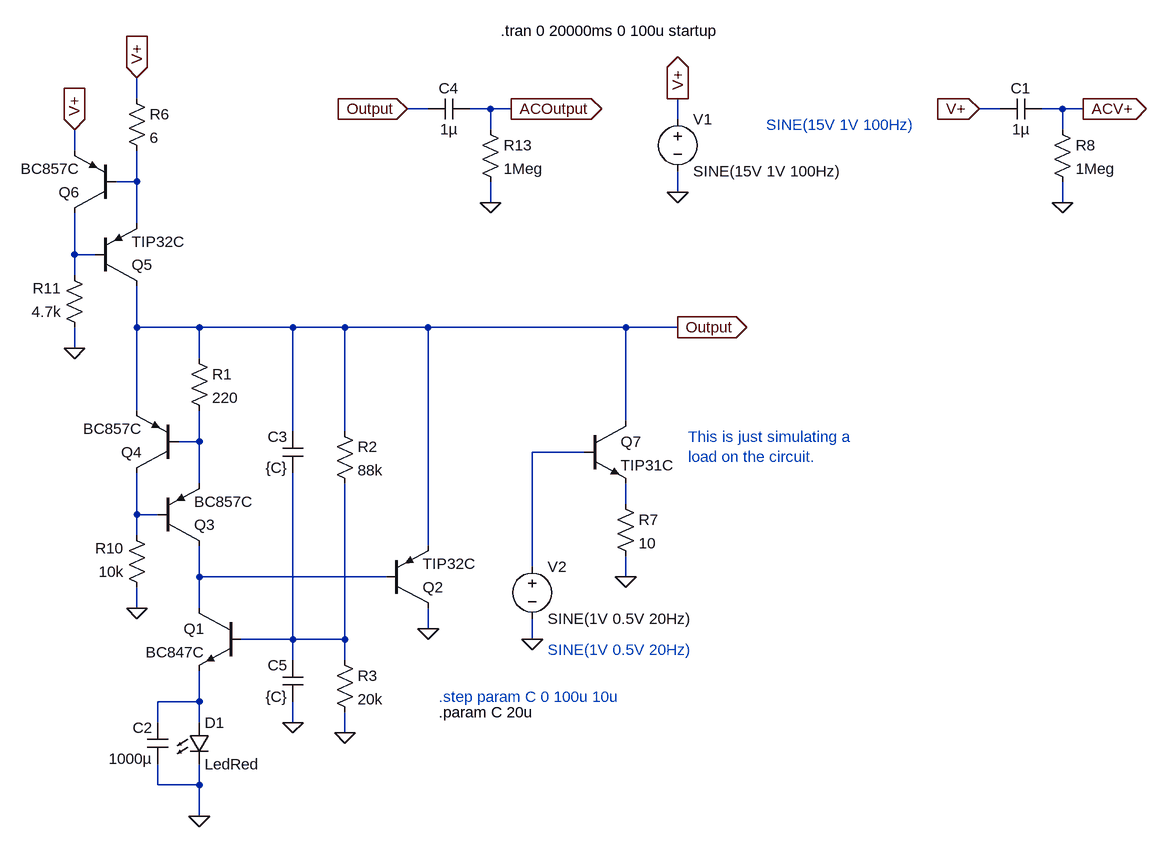
[diagram p0: schematic Shunt Regulator.asc]
Shunt Regulator.asc, the LTspice schematic file:
Version 4
SHEET 1 4220 820
WIRE 896 -304 896 -336
WIRE 1344 -288 1312 -288
WIRE 1440 -288 1408 -288
WIRE 1472 -288 1440 -288
WIRE 2224 -288 2192 -288
WIRE 2320 -288 2288 -288
WIRE 2352 -288 2320 -288
WIRE 1728 -272 1728 -304
WIRE 1440 -256 1440 -288
WIRE 2320 -256 2320 -288
WIRE 800 -224 800 -256
WIRE 896 -176 896 -224
WIRE 896 -176 864 -176
WIRE 1728 -160 1728 -192
WIRE 1440 -144 1440 -176
WIRE 2320 -144 2320 -176
WIRE 896 -112 896 -176
WIRE 800 -64 800 -128
WIRE 832 -64 800 -64
WIRE 800 -32 800 -64
WIRE 896 48 896 -16
WIRE 992 48 896 48
WIRE 1136 48 992 48
WIRE 1216 48 1136 48
WIRE 1344 48 1216 48
WIRE 1648 48 1344 48
WIRE 1728 48 1648 48
WIRE 800 80 800 48
WIRE 992 96 992 48
WIRE 896 176 896 48
WIRE 1648 192 1648 48
WIRE 1136 208 1136 48
WIRE 1216 208 1216 48
WIRE 992 224 992 176
WIRE 992 224 960 224
WIRE 1584 240 1504 240
WIRE 992 288 992 224
WIRE 1648 320 1648 288
WIRE 896 336 896 272
WIRE 928 336 896 336
WIRE 896 368 896 336
WIRE 1344 384 1344 48
WIRE 1504 416 1504 240
WIRE 992 432 992 384
WIRE 1280 432 992 432
WIRE 1648 432 1648 400
WIRE 896 480 896 448
WIRE 992 480 992 432
WIRE 1344 512 1344 480
WIRE 1136 528 1136 272
WIRE 1136 528 1056 528
WIRE 1216 528 1216 288
WIRE 1216 528 1136 528
WIRE 1504 528 1504 496
WIRE 1136 560 1136 528
WIRE 1216 560 1216 528
WIRE 992 624 992 576
WIRE 992 624 928 624
WIRE 928 656 928 624
WIRE 992 656 992 624
WIRE 1136 656 1136 624
WIRE 1216 672 1216 640
WIRE 928 752 928 720
WIRE 992 752 992 720
WIRE 992 752 928 752
WIRE 992 800 992 752
FLAG 1728 -160 0
FLAG 1728 -304 V+
IOPIN 1728 -304 Out
FLAG 1344 512 0
FLAG 896 480 0
FLAG 896 -336 V+
IOPIN 896 -336 In
FLAG 800 80 0
FLAG 800 -256 V+
IOPIN 800 -256 In
FLAG 1312 -288 Output
IOPIN 1312 -288 In
FLAG 1440 -144 0
FLAG 1472 -288 ACOutput
IOPIN 1472 -288 Out
FLAG 992 800 0
FLAG 1216 672 0
FLAG 1728 48 Output
IOPIN 1728 48 Out
FLAG 1504 528 0
FLAG 1648 432 0
FLAG 2192 -288 V+
IOPIN 2192 -288 In
FLAG 2320 -144 0
FLAG 2352 -288 ACV+
IOPIN 2352 -288 Out
FLAG 1136 656 0
SYMBOL voltage 1728 -288 R0
WINDOW 123 0 0 Left 0
WINDOW 39 0 0 Left 0
SYMATTR InstName V1
SYMATTR Value SINE(15V 1V 100Hz)
SYMBOL pnp 928 384 M180
SYMATTR InstName Q3
SYMATTR Value BC857C
SYMBOL res 912 464 R180
WINDOW 0 36 76 Left 2
WINDOW 3 36 40 Left 2
SYMATTR InstName R10
SYMATTR Value 10k
SYMBOL pnp 960 272 R180
SYMATTR InstName Q4
SYMATTR Value BC857C
SYMBOL res 880 -320 R0
SYMATTR InstName R6
SYMATTR Value 6
SYMBOL pnp 832 -16 M180
SYMATTR InstName Q5
SYMATTR Value TIP32C
SYMBOL res 816 64 R180
WINDOW 0 36 76 Left 2
WINDOW 3 36 40 Left 2
SYMATTR InstName R11
SYMATTR Value 4.7k
SYMBOL pnp 864 -128 R180
SYMATTR InstName Q6
SYMATTR Value BC857C
SYMBOL cap 1408 -304 R90
WINDOW 0 0 32 VBottom 2
WINDOW 3 32 32 VTop 2
SYMATTR InstName C4
SYMATTR Value 1µ
SYMBOL res 1424 -272 R0
SYMATTR InstName R13
SYMATTR Value 1Meg
SYMBOL npn 1056 480 M0
SYMATTR InstName Q1
SYMATTR Value BC847C
SYMBOL LED 976 656 R0
SYMATTR InstName D1
SYMATTR Value LedRed
SYMBOL res 976 80 R0
SYMATTR InstName R1
SYMATTR Value 220
SYMBOL res 1200 192 R0
SYMATTR InstName R2
SYMATTR Value 88k
SYMBOL res 1200 544 R0
SYMATTR InstName R3
SYMATTR Value 20k
SYMBOL pnp 1280 480 M180
SYMATTR InstName Q2
SYMATTR Value TIP32C
SYMBOL npn 1584 192 R0
SYMATTR InstName Q7
SYMATTR Value TIP31C
SYMBOL voltage 1504 400 R0
WINDOW 123 0 0 Left 0
WINDOW 39 0 0 Left 0
SYMATTR InstName V2
SYMATTR Value SINE(1V 0.5V 20Hz)
SYMBOL res 1632 304 R0
SYMATTR InstName R7
SYMATTR Value 10
SYMBOL cap 2288 -304 R90
WINDOW 0 0 32 VBottom 2
WINDOW 3 32 32 VTop 2
SYMATTR InstName C1
SYMATTR Value 1µ
SYMBOL res 2304 -272 R0
SYMATTR InstName R8
SYMATTR Value 1Meg
SYMBOL cap 944 656 M0
SYMATTR InstName C2
SYMATTR Value 1000µ
SYMBOL cap 1152 208 M0
SYMATTR InstName C3
SYMATTR Value {C}
SYMBOL cap 1152 560 M0
SYMATTR InstName C5
SYMATTR Value {C}
TEXT 1456 -408 Left 2 !.tran 0 20000ms 0 100u startup
TEXT 1864 -264 Left 2 ;SINE(15V 1V 100Hz)
TEXT 1744 216 Left 2 ;This is just simulating a\nload on the circuit.
TEXT 1528 544 Left 2 ;SINE(1V 0.5V 20Hz)
TEXT 1360 616 Left 2 ;.step param C 0 100u 10u
TEXT 1360 640 Left 2 !.param C 20u

The netlist it stands for:
* Shunt Regulator.asc
V1 V+ 0 SINE(15V 1V 100Hz)
Q3 N007 N006 N003 0 BC857C
R10 0 N006 10k
Q4 N006 N003 Output 0 BC857C
R6 V+ N001 6
Q5 Output N002 N001 0 TIP32C
R11 0 N002 4.7k
Q6 N002 N001 V+ 0 BC857C
C4 ACOutput Output 1µ
R13 ACOutput 0 1Meg
Q1 N007 N008 N009 0 BC847C
D1 N009 0 LedRed
R1 Output N003 220
R2 Output N008 88k
R3 N008 0 20k
Q2 0 N007 Output 0 TIP32C
Q7 Output N004 N005 0 TIP31C
V2 N004 0 SINE(1V 0.5V 20Hz)
R7 N005 0 10
C1 ACV+ V+ 1µ
R8 ACV+ 0 1Meg
C2 N009 0 1000µ
C3 Output N008 {C}
C5 N008 0 {C}
.model D D
.lib standard.dio
.model NPN NPN
.model PNP PNP
.lib standard.bjt
.tran 0 20000ms 0 100u startup
* SINE(15V 1V 100Hz)
* This is just simulating a
* load on the circuit.
* SINE(1V 0.5V 20Hz)
* .step param C 0 100u 10u
.param C 20u
.backanno
.end